# Altium schematic sheet ASBB_GiantGecko_v2.SchDoc
size A4
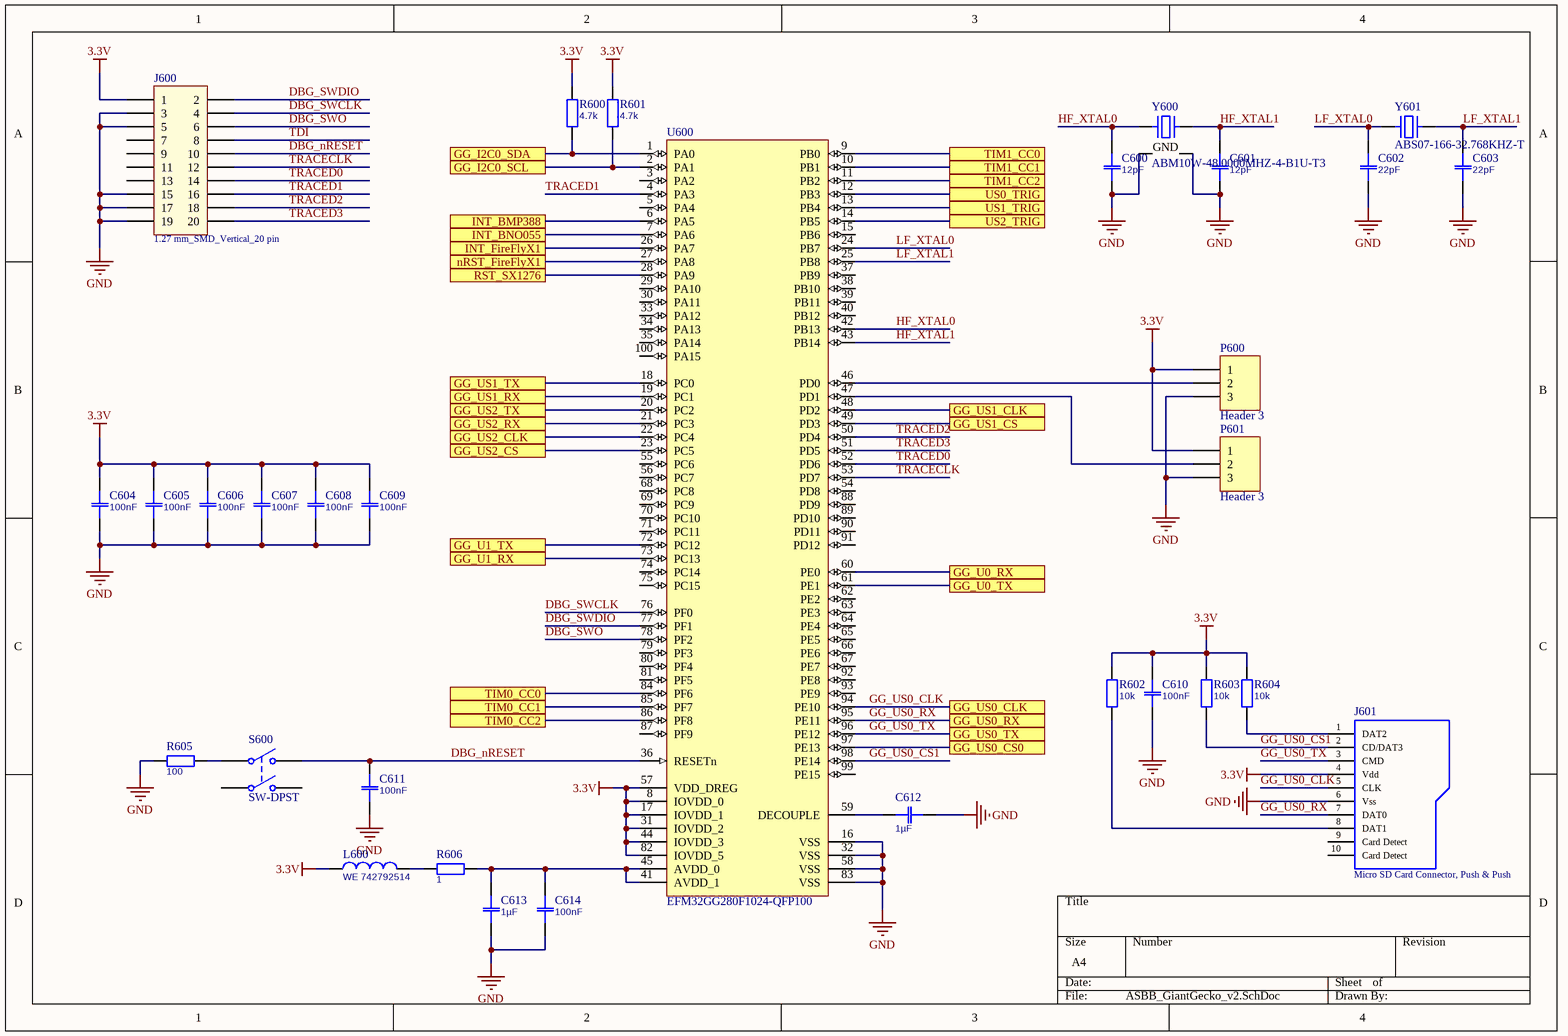
[diagram p0: ASBB_GiantGecko_v2.SchDoc]

## Parts
C600  12pF  [0603]
C601  12pF  [0603]
C602  22pF  [0603]
C603  22pF  [0603]
C604  100nF  [0603]
C605  100nF  [0603]
C606  100nF  [0603]
C607  100nF  [0603]
C608  100nF  [0603]
C609  100nF  [0603]
C610  100nF  [0603]
C611  100nF  [0603]
C612  1µF  [0603]
C613  1µF  [0603]
C614  100nF  [0603]
J600  1.27 mm_SMD_Vertical_20 pin  [62102021021]
J601  Micro SD Card Connector, Push & Push  [693071010811]
L600  WE 742792514  [1812]
P600  Header 3  [HDR1X3]
P601  Header 3  [HDR1X3]
R600  4.7k  [0603]
R601  4.7k  [0603]
R602  10k  [0603]
R603  10k  [0603]
R604  10k  [0603]
R605  100  [0603]
R606  1  [0603]
S600  SW-DPST  [DPST-4]
U600  EFM32GG280F1024-QFP100  [ENMR-LQFP100_N]
Y600  ABM10W-48.0000MHZ-4-B1U-T3
Y601  ABS07-166-32.768KHZ-T

## Ports
GG_I2C0_SCL, GG_I2C0_SDA, GG_U0_RX, GG_U0_TX, GG_U1_RX, GG_U1_TX, GG_US0_CLK, GG_US0_CS0, GG_US0_RX, GG_US0_TX, GG_US1_CLK, GG_US1_CS, GG_US1_RX, GG_US1_TX, GG_US2_CLK, GG_US2_CS, GG_US2_RX, GG_US2_TX, INT_BMP388, INT_BNO055, INT_FireFlyX1, nRST_FireFlyX1, RST_SX1276, TIM0_CC0, TIM0_CC1, TIM0_CC2, TIM1_CC0, TIM1_CC1, TIM1_CC2, US0_TRIG, US1_TRIG, US2_TRIG

## Nets
3.3V: C604.1 C605.1 C606.1 C607.1 C608.1 C609.1 C610.1 J600.1 J601.4(Vdd) L600.1 P600.1 P601.1 R600.2 R601.2 R602.2 R603.2 R604.2 U600.8(IOVDD_0) U600.17(IOVDD_1) U600.31(IOVDD_2) U600.44(IOVDD_3) U600.57(VDD_DREG) U600.82(IOVDD_5)
GND: C600.2 C601.2 C602.2 C603.2 C604.2 C605.2 C606.2 C607.2 C608.2 C609.2 C610.2 C611.2 C612.2 C613.2 C614.2 J600.3 J600.5 J600.15 J600.17 J600.19 J601.6(Vss) P600.3 P601.3 R605.1 U600.16(VSS) U600.32(VSS) U600.58(VSS) U600.83(VSS) Y600.2(GND) Y600.4(GND)
DBG_nRESET: C611.1 J600.10 S600.2(NO1) U600.36(RESETn)
DBG_SWCLK: J600.4 U600.76(PF0)
DBG_SWDIO: J600.2 U600.77(PF1)
DBG_SWO: J600.6 U600.78(PF2)
GG_I2C0_SCL: R601.1 U600.2(PA1) ; port GG_I2C0_SCL
GG_I2C0_SDA: R600.1 U600.1(PA0) ; port GG_I2C0_SDA
GG_U0_RX: U600.60(PE0) ; port GG_U0_RX
GG_U0_TX: U600.61(PE1) ; port GG_U0_TX
GG_U1_RX: U600.73(PC13) ; port GG_U1_RX
GG_U1_TX: U600.72(PC12) ; port GG_U1_TX
GG_US0_CLK: J601.5(CLK) U600.94(PE10) ; port GG_US0_CLK
GG_US0_CS0: U600.97(PE13) ; port GG_US0_CS0
GG_US0_CS1: J601.2(CD/DAT3) R603.1 U600.98(PE14)
GG_US0_RX: J601.7(DAT0) U600.95(PE11) ; port GG_US0_RX
GG_US0_TX: J601.3(CMD) U600.96(PE12) ; port GG_US0_TX
GG_US1_CLK: U600.48(PD2) ; port GG_US1_CLK
GG_US1_CS: U600.49(PD3) ; port GG_US1_CS
GG_US1_RX: U600.19(PC1) ; port GG_US1_RX
GG_US1_TX: U600.18(PC0) ; port GG_US1_TX
GG_US2_CLK: U600.22(PC4) ; port GG_US2_CLK
GG_US2_CS: U600.23(PC5) ; port GG_US2_CS
GG_US2_RX: U600.21(PC3) ; port GG_US2_RX
GG_US2_TX: U600.20(PC2) ; port GG_US2_TX
HF_XTAL0: C600.1 U600.42(PB13) Y600.1
HF_XTAL1: C601.1 U600.43(PB14) Y600.3
INT_BMP388: U600.6(PA5) ; port INT_BMP388
INT_BNO055: U600.7(PA6) ; port INT_BNO055
INT_FireFlyX1: U600.26(PA7) ; port INT_FireFlyX1
LF_XTAL0: C602.1 U600.24(PB7) Y601.1
LF_XTAL1: C603.1 U600.25(PB8) Y601.2
nRST_FireFlyX1: U600.27(PA8) ; port nRST_FireFlyX1
RST_SX1276: U600.28(PA9) ; port RST_SX1276
TDI: J600.8
TIM0_CC0: U600.84(PF6) ; port TIM0_CC0
TIM0_CC1: U600.85(PF7) ; port TIM0_CC1
TIM0_CC2: U600.86(PF8) ; port TIM0_CC2
TIM1_CC0: U600.9(PB0) ; port TIM1_CC0
TIM1_CC1: U600.10(PB1) ; port TIM1_CC1
TIM1_CC2: U600.11(PB2) ; port TIM1_CC2
TRACECLK: J600.12 U600.53(PD7)
TRACED0: J600.14 U600.52(PD6)
TRACED1: J600.16 U600.4(PA3)
TRACED2: J600.18 U600.50(PD4)
TRACED3: J600.20 U600.51(PD5)
US0_TRIG: U600.12(PB3) ; port US0_TRIG
US1_TRIG: U600.13(PB4) ; port US1_TRIG
US2_TRIG: U600.14(PB5) ; port US2_TRIG
NetC612_1: C612.1 U600.59(DECOUPLE)
NetC613_1: C613.1 C614.1 R606.2 U600.41(AVDD_1) U600.45(AVDD_0)
NetJ601_1: J601.1(DAT2) R604.1
NetJ601_8: J601.8(DAT1) R602.1
NetL600_2: L600.2 R606.1
NetP600_2: P600.2 U600.46(PD0)
NetP601_2: P601.2 U600.47(PD1)
NetR605_2: R605.2 S600.1(COMMON1)

Not connected (* = marked no-connect by the designer): J600 7 9 11 13; J601 9(Card_Detect) 10(Card_Detect); S600 3(COMMON2) 4(NO2); U600 3(PA2) 5(PA4) 15(PB6) 29(PA10) 30(PA11) 33(PA12) 34(PA13) 35(PA14) 37(PB9) 38(PB10) 39(PB11) 40(PB12) 54(PD8) 55(PC6) 56(PC7) 62(PE2) 63(PE3) 64(PE4) 65(PE5) 66(PE6) 67(PE7) 68(PC8) 69(PC9) 70(PC10) 71(PC11) 74(PC14) 75(PC15) 79(PF3) 80(PF4) 81(PF5) 87(PF9) 88(PD9) 89(PD10) 90(PD11) 91(PD12) 92(PE8) 93(PE9) 99(PE15) 100(PA15)

## Library data of the parts
C600-C614 = Capacitor: Partnumber: ?; Value: ?
J600 = 62102021021: Pin Header WR-PHD, pitch 1.27 mm, SMD, Vertical, dual row, 20 pin; Rated Current: 1 A; Pin Number: 20; Pitch: 1.27 mm; Working Voltage: 100 VAC; Contact Resistance: 20 mOhm; Insulation Resistance: >1000 MOhm; ComponentLink1Description: Manufacturer; ComponentLink1URL: http://www.we-online.de; ComponentLink2Description: Datasheet; ComponentLink2URL: http://katalog.we-online.de/em/datasheet/62102021021.pdf; Part Number: 62102021021; Published Date: Jan. 2018; Publisher: Wurth Elektronik; Operating Temperature: -40 to 105 degC; Mounting Technology: SMD; Row Number: Dual; Orientation: Vertical
J601 = 693071010811: WR-CRD Micro SD Card Connector, Push & Push, with card detection; Rated Current: 0.5A; Working Voltage: 500V AC; ComponentLink1Description: Manufacturer; ComponentLink1URL: http://www.we-online.de; ComponentLink2Description: Datasheet; ComponentLink2URL: http://katalog.we-online.de/em/datasheet/693071010811.pdf; Part Number: 693071010811; Published Date: Feb. 2018; Publisher: Wurth Elektronik; Operating Temperature: -25 to 85 degC; Mounting Technology: SMT
L600 = Inductor: Partnumber: ?; Value: ?
P600 P601 = Header 3: Header, 3-Pin; LatestRevisionDate: 17-Jul-2002; LatestRevisionNote: Re-released for DXP Platform.; Publisher: Altium Limited
R600-R606 = Resistor: Partnumber: ?; Value: ?
S600 = SW-DPST: Double-Pole, Single-Throw Switch; Published: 24-Mar-1999; LatestRevisionDate: 17-Jul-2002; LatestRevisionNote: Re-released for DXP Platform.; PackageReference: DPST-4; Publisher: Altium Limited; PackageDescription: Switch; 4 Leads
U600 = EFM32GG280F1024-QFP100: EFM32 Giant Gecko, M3 ARM Cortex CPU, 1024 KB Flash, 128 KB RAM, 1.85 - 3.8 V Supply, 48 MHz Max Speed, -40 to 85 degC, 100-Pin LQFP, RoHS Compliant; Flash (KB): 1024; GPIO: 86; LESENSE: Y; Max Speed (MHz): 48; OPAMPS: 3; RAM (KB): 128; DatasheetVersion: Rev 1.00; PackageVersion: Rev. 98A0100QP043_03MAY2007; PackageReference: LQFP100; PackageDescription: 100-Pin Low rofile Quad Flat Package, Body 14 x 14 mm, Pitch 0.5 mm; Supplier 1: Digi-Key; Supplier Part Number 1: 914-1061-2-ND; Supplier 2: Digi-Key; Supplier Part Number 2: 914-1061-1-ND; Supplier 3: Digi-Key; Supplier Part Number 3: 914-1061-6-ND; Supplier 4: Mouser; Supplier Part Number 4: 904-EFM32GG280F1024; ARM Cortex CPU: M3; Subcategory: EFM32 Giant Gecko; Supply Voltage (V): 1.85 - 3.8; Mounting Technology: Surface Mount; Generic Part Number: EFM32GG280; PartNumber: EFM32GG280F1024-QFP100; ComponentLink1Description: Manufacturer URL; ComponentLink1URL: http://www.energymicro.com/; ComponentLink2Description: Datasheet; ComponentLink2URL: http://cdn.energymicro.com/dl/devices/pdf/d0036_efm32gg280_datasheet.pdf; ComponentLink3Description: Package Specification; ComponentLink3URL: http://cdn.energymicro.com/dl/devices/pdf/d0006_efm32g280_datasheet.pdf
Y600 = Abracon Crystal ABM10: SMT Crystal
Y601 = Abracon Crystal ABS06: SMT Crystal